# EAGLE schematic 1x3Top (EAGLE 7.3.0)
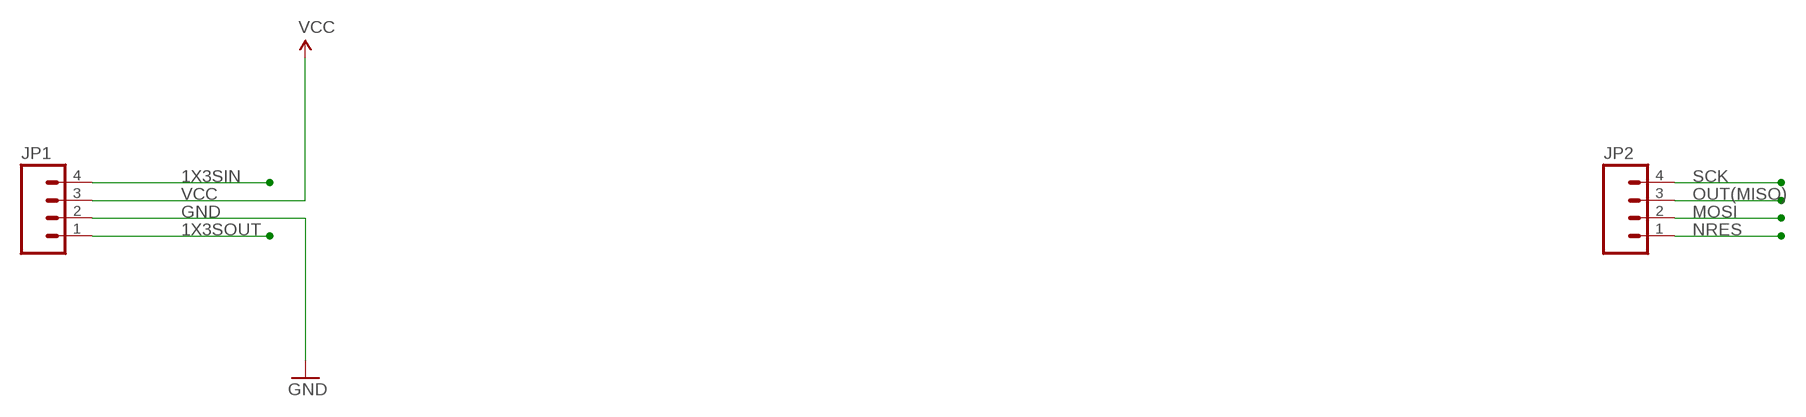
[diagram p0: schematic, sheet 1]

## Parts
JP1  M04PTH  [1X04]
JP2  M04PTH  [1X04]

## Nets
1X3SIN: JP1.4
1X3SOUT: JP1.1
GND: JP1.2
MOSI: JP2.2
NRES: JP2.1
OUT(MISO): JP2.3
SCK: JP2.4
VCC: JP1.3

## Library data of the parts
JP1 JP2 = SparkFun-Connectors:M04: Header 4 Standard 4-pin 0.1" header. Use with straight break away headers (SKU : PRT-00116), right angle break away headers (PRT-00553), swiss pins (PRT-00743), machine pins (PRT-00117), and female headers (PRT-00115). Molex polarized connector foot print use with SKU : PRT-08231 with associated crimp pins and housings. 1MM SMD Version SKU: PRT-10208